# EAGLE design wakeup (EAGLE 7.7.0)

## Sheet 1 of 2: Main - Connectors and Microcontroller
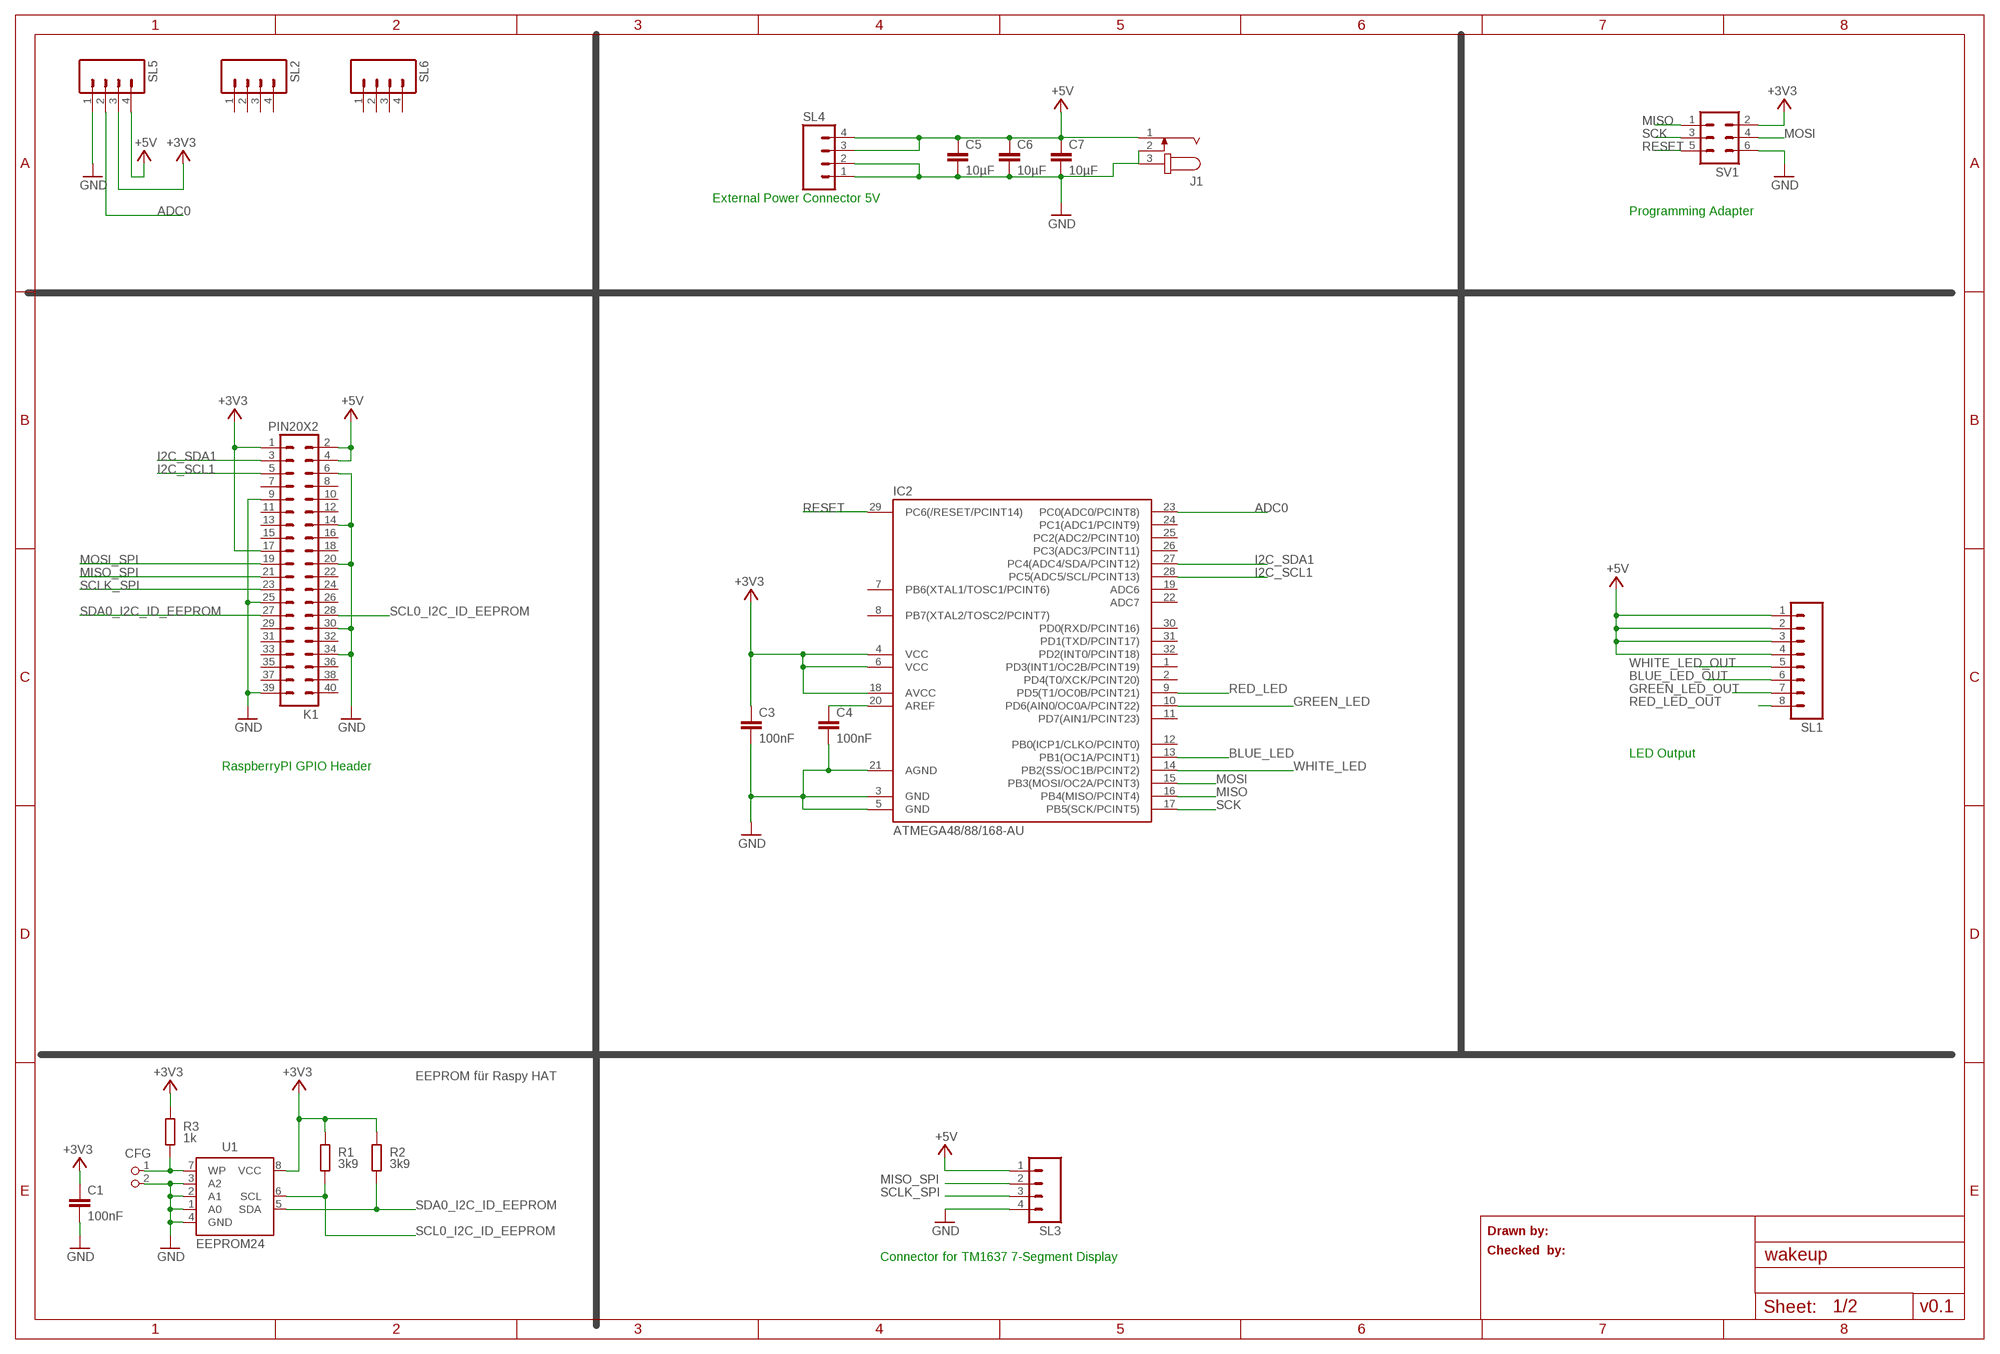
[diagram p0: schematic, sheet 1]

### Parts
C1  100nF  C-EUC0805K  [C0805K]
C3  100nF  C-EUC0603  [C0603]
C4  100nF  C-EUC0603  [C0603]
C5  10µF  C-EUC0805  [C0805]
C6  10µF  C-EUC0805  [C0805]
C7  10µF  C-EUC0805  [C0805]
CFG  PIN2_100  [PIN_W_2]
IC2  ATMEGA48/88/168-AU  [TQFP32-08]
J1  JACK-PLUG1  [SPC4078]
K1  PIN20X2  [PIN_20X2]
R1  3k9  R-EU_M0805  [M0805]
R2  3k9  R-EU_M0805  [M0805]
R3  1k  R-EU_M0805  [M0805]
SL1  M08  [08P]
SL2  M04  [04P]
SL3  M04  [04P]
SL4  M04  [04P]
SL5  M04  [04P]
SL6  M04  [04P]
SV1  ML6  [ML6]
U1  EEPROM24  [SOIC8]

### Nets
+3V3: C1.1 C3.1 IC2.4(VCC) IC2.6(VCC) IC2.18(AVCC) K1.1 K1.17 R1.2 R2.2 R3.2 SL5.3 SV1.2 U1.8(VCC)
+5V: C5.1 C6.1 C7.1 J1.1 K1.2 K1.4 SL1.1 SL1.2 SL1.3 SL1.4 SL3.1 SL4.3 SL4.4 SL5.4 ; also sheet 2
ADC0: IC2.23(PC0(ADC0/PCINT8)) SL5.2
BLUE_LED: IC2.13(PB1(OC1A/PCINT1)) ; also sheet 2
BLUE_LED_OUT: SL1.6 ; also sheet 2
GND: C1.2 C3.2 C4.2 C5.2 C6.2 C7.2 CFG.2 IC2.3(GND) IC2.5(GND) IC2.21(AGND) J1.2 J1.3 K1.6 K1.9 K1.14 K1.20 K1.25 K1.30 K1.34 K1.39 SL3.4 SL4.1 SL4.2 SL5.1 SV1.6 U1.1(A0) U1.2(A1) U1.3(A2) U1.4(GND) ; also sheet 2
GREEN_LED: IC2.10(PD6(AIN0/OC0A/PCINT22)) ; also sheet 2
GREEN_LED_OUT: SL1.7 ; also sheet 2
I2C_SCL1: IC2.28(PC5(ADC5/SCL/PCINT13)) K1.5
I2C_SDA1: IC2.27(PC4(ADC4/SDA/PCINT12)) K1.3
MISO: IC2.16(PB4(MISO/PCINT4)) SV1.1
MISO_SPI: K1.21 SL3.2
MOSI: IC2.15(PB3(MOSI/OC2A/PCINT3)) SV1.4
MOSI_SPI: K1.19
N$3: CFG.1 R3.1 U1.7(WP)
N$4: C4.1 IC2.20(AREF)
RED_LED: IC2.9(PD5(T1/OC0B/PCINT21)) ; also sheet 2
RED_LED_OUT: SL1.8 ; also sheet 2
RESET: IC2.29(PC6(/RESET/PCINT14)) SV1.5
SCK: IC2.17(PB5(SCK/PCINT5)) SV1.3
SCL0_I2C_ID_EEPROM: K1.28 R1.1 U1.6(SCL)
SCLK_SPI: K1.23 SL3.3
SDA0_I2C_ID_EEPROM: K1.27 R2.1 U1.5(SDA)
WHITE_LED: IC2.14(PB2(SS/OC1B/PCINT2)) ; also sheet 2
WHITE_LED_OUT: SL1.5 ; also sheet 2
Unconnected: IC2.1(PD3(INT1/OC2B/PCINT19)) IC2.2(PD4(T0/XCK/PCINT20)) IC2.7(PB6(XTAL1/TOSC1/PCINT6)) IC2.8(PB7(XTAL2/TOSC2/PCINT7)) IC2.11(PD7(AIN1/PCINT23)) IC2.12(PB0(ICP1/CLKO/PCINT0)) IC2.19(ADC6) IC2.22(ADC7) IC2.24(PC1(ADC1/PCINT9)) IC2.25(PC2(ADC2/PCINT10)) IC2.26(PC3(ADC3/PCINT11)) IC2.30(PD0(RXD/PCINT16)) IC2.31(PD1(TXD/PCINT17)) IC2.32(PD2(INT0/PCINT18)) K1.7 K1.8 K1.10 K1.11 K1.12 K1.13 K1.15 K1.16 K1.18 K1.22 K1.24 K1.26 K1.29 K1.31 K1.32 K1.33 K1.35 K1.36 K1.37 K1.38 K1.40 SL2.1 SL2.2 SL2.3 SL2.4 SL6.1 SL6.2 SL6.3 SL6.4

### Notes on the sheet
- External Power Connector 5V
- Programming Adapter
- LED Output
- RaspberryPI GPIO Header
- EEPROM für Raspy HAT
- Drawn by:
- Checked  by:
- Connector for TM1637 7-Segment Display
- v0.1

## Sheet 2 of 2: LEDs und LED-Treiber
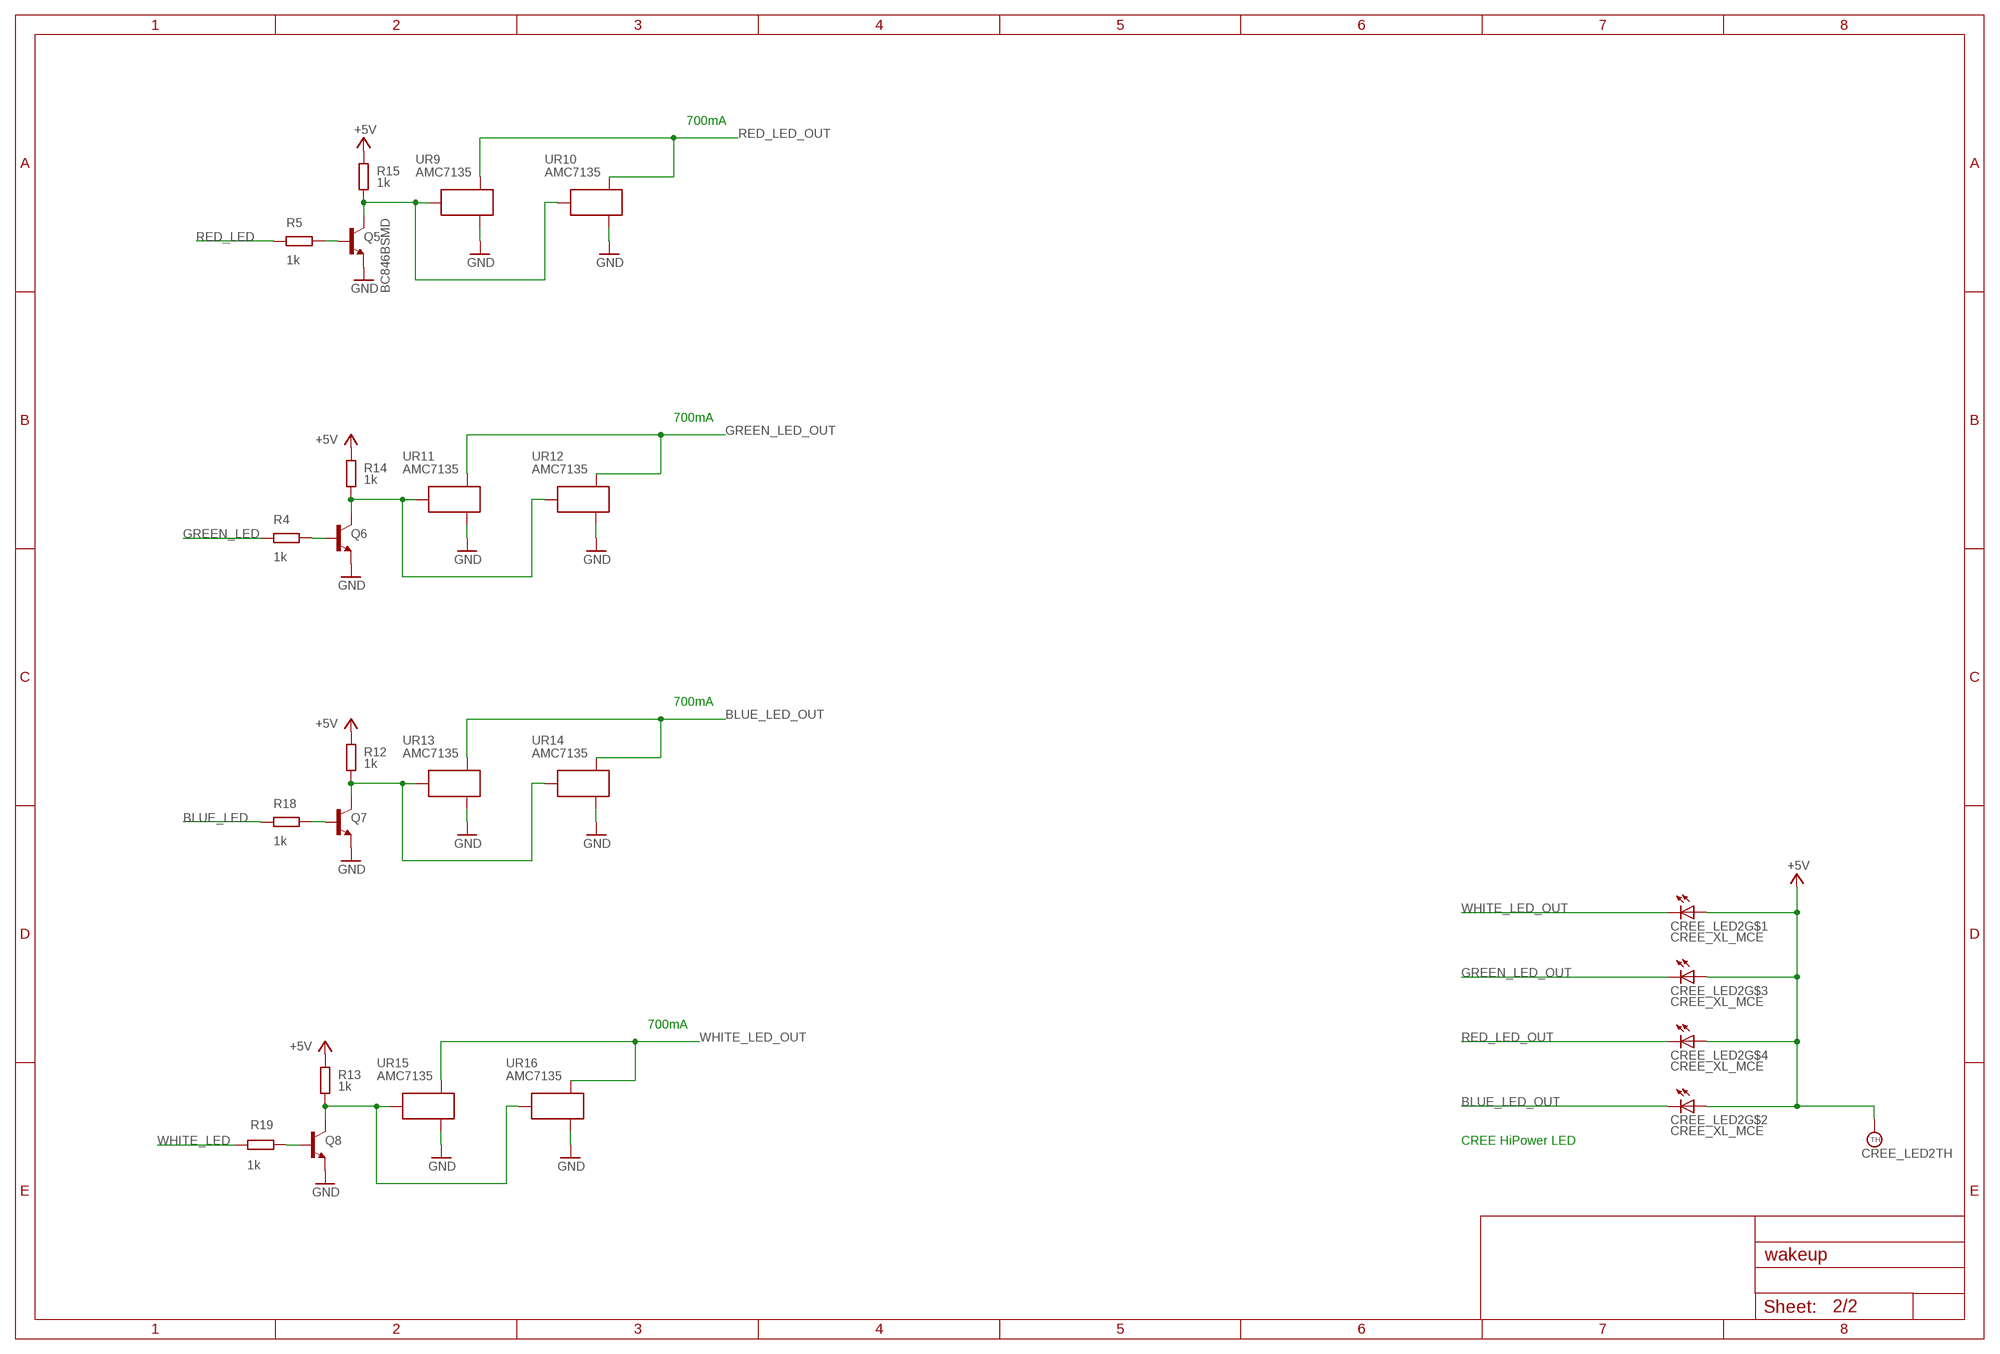
[diagram p1: schematic, sheet 2]

### Parts
CREE_LED2  CREE_XL_MCE  [CREE_XL_MCE]
Q5  BC846BSMD  [SOT23]
Q6  BC846BSMD  [SOT23]
Q7  BC846BSMD  [SOT23]
Q8  BC846BSMD  [SOT23]
R4  1k  R-EU_M0805  [M0805]
R5  1k  R-EU_M0805  [M0805]
R12  1k  R-EU_R0603  [R0603]
R13  1k  R-EU_R0603  [R0603]
R14  1k  R-EU_R0603  [R0603]
R15  1k  R-EU_R0603  [R0603]
R18  1k  R-EU_M0805  [M0805]
R19  1k  R-EU_M0805  [M0805]
UR9  AMC7135  [SOT]
UR10  AMC7135  [SOT]
UR11  AMC7135  [SOT]
UR12  AMC7135  [SOT]
UR13  AMC7135  [SOT]
UR14  AMC7135  [SOT]
UR15  AMC7135  [SOT]
UR16  AMC7135  [SOT]

### Nets
+5V: CREE_LED2.1(A) CREE_LED2.2(A) CREE_LED2.3(A) CREE_LED2.4(A) CREE_LED2.HT(TH:TH) R12.2 R13.2 R14.2 R15.2 ; also sheet 1
BLUE_LED: R18.2 ; also sheet 1
BLUE_LED_OUT: CREE_LED2.7(C) UR13.1(OUT) UR14.1(OUT) ; also sheet 1
BLUE_POWER: Q7.3(C) R12.1 UR13.3(VDD) UR14.3(VDD)
GND: Q5.2(E) Q6.2(E) Q7.2(E) Q8.2(E) UR9.2(GND) UR9.2@1(GND) UR10.2(GND) UR10.2@1(GND) UR11.2(GND) UR11.2@1(GND) UR12.2(GND) UR12.2@1(GND) UR13.2(GND) UR13.2@1(GND) UR14.2(GND) UR14.2@1(GND) UR15.2(GND) UR15.2@1(GND) UR16.2(GND) UR16.2@1(GND) ; also sheet 1
GREEN_LED: R4.2 ; also sheet 1
GREEN_LED_OUT: CREE_LED2.6(C) UR11.1(OUT) UR12.1(OUT) ; also sheet 1
GREEN_POWER: Q6.3(C) R14.1 UR11.3(VDD) UR12.3(VDD)
N$5: Q8.1(B) R19.1
N$6: Q7.1(B) R18.1
N$7: Q5.1(B) R5.1
N$8: Q6.1(B) R4.1
RED_LED: R5.2 ; also sheet 1
RED_LED_OUT: CREE_LED2.5(C) UR9.1(OUT) UR10.1(OUT) ; also sheet 1
RED_POWER: Q5.3(C) R15.1 UR9.3(VDD) UR10.3(VDD)
WHITE_LED: R19.2 ; also sheet 1
WHITE_LED_OUT: CREE_LED2.8(C) UR15.1(OUT) UR16.1(OUT) ; also sheet 1
WHITE_POWER: Q8.3(C) R13.1 UR15.3(VDD) UR16.3(VDD)

### Notes on the sheet
- 700mA
- 700mA
- 700mA
- 700mA
- CREE HiPower LED

## Library data of the parts
C1 = resistor:C-EU: CAPACITOR, European symbol; DIELECTRIC: X7R
C3-C7 = rcl:C-EU: CAPACITOR, European symbol
CFG = FLYFISH:PIN2
CREE_LED2 = CreeXL-MC-E:CREE_XL_MCE: Cree® LED
IC2 = atmega8:ATMEGA48/88/168
J1 = con-jack:JACK-PLUG: DC POWER JACK Power Jack, DC, Right Angle, Through Hole, Rated 5A at 16VDC, PC Terminals Distributor: Farnell (www.Farnell.de) Drawing: 84N1161.pdf / 84N1162.pdf Manufacturer: SPC Technology (www.spctechnology.com) Type: SPC4077 / SPC 4078; OC_FARNELL: unknown; OC_NEWARK: unknown
K1 = FLYFISH:PIN20X2
Q5-Q8 = transistor-npn:BC846*: NPN Transistor
R1-R5 R12-R15 R18 R19 = resistor:R-EU_: RESISTOR, European symbol; TOLERANCE: 5%
SL1 = con-amp-quick:M08: AMP QUICK CONNECTOR; OC_FARNELL: unknown; OC_NEWARK: unknown
SL2-SL6 = con-amp-quick:M04: AMP QUICK CONNECTOR; OC_FARNELL: unknown; OC_NEWARK: unknown
SV1 = con-ml:ML6: HARTING; OC_FARNELL: unknown; OC_NEWARK: unknown
U1 = FLYFISH:EEPROM24
UR9-UR16 = 1:AMC7135: Spannungsregler AMC7135 http://www.micro-bridge.com/data/add/amc7135.pdf

## Board
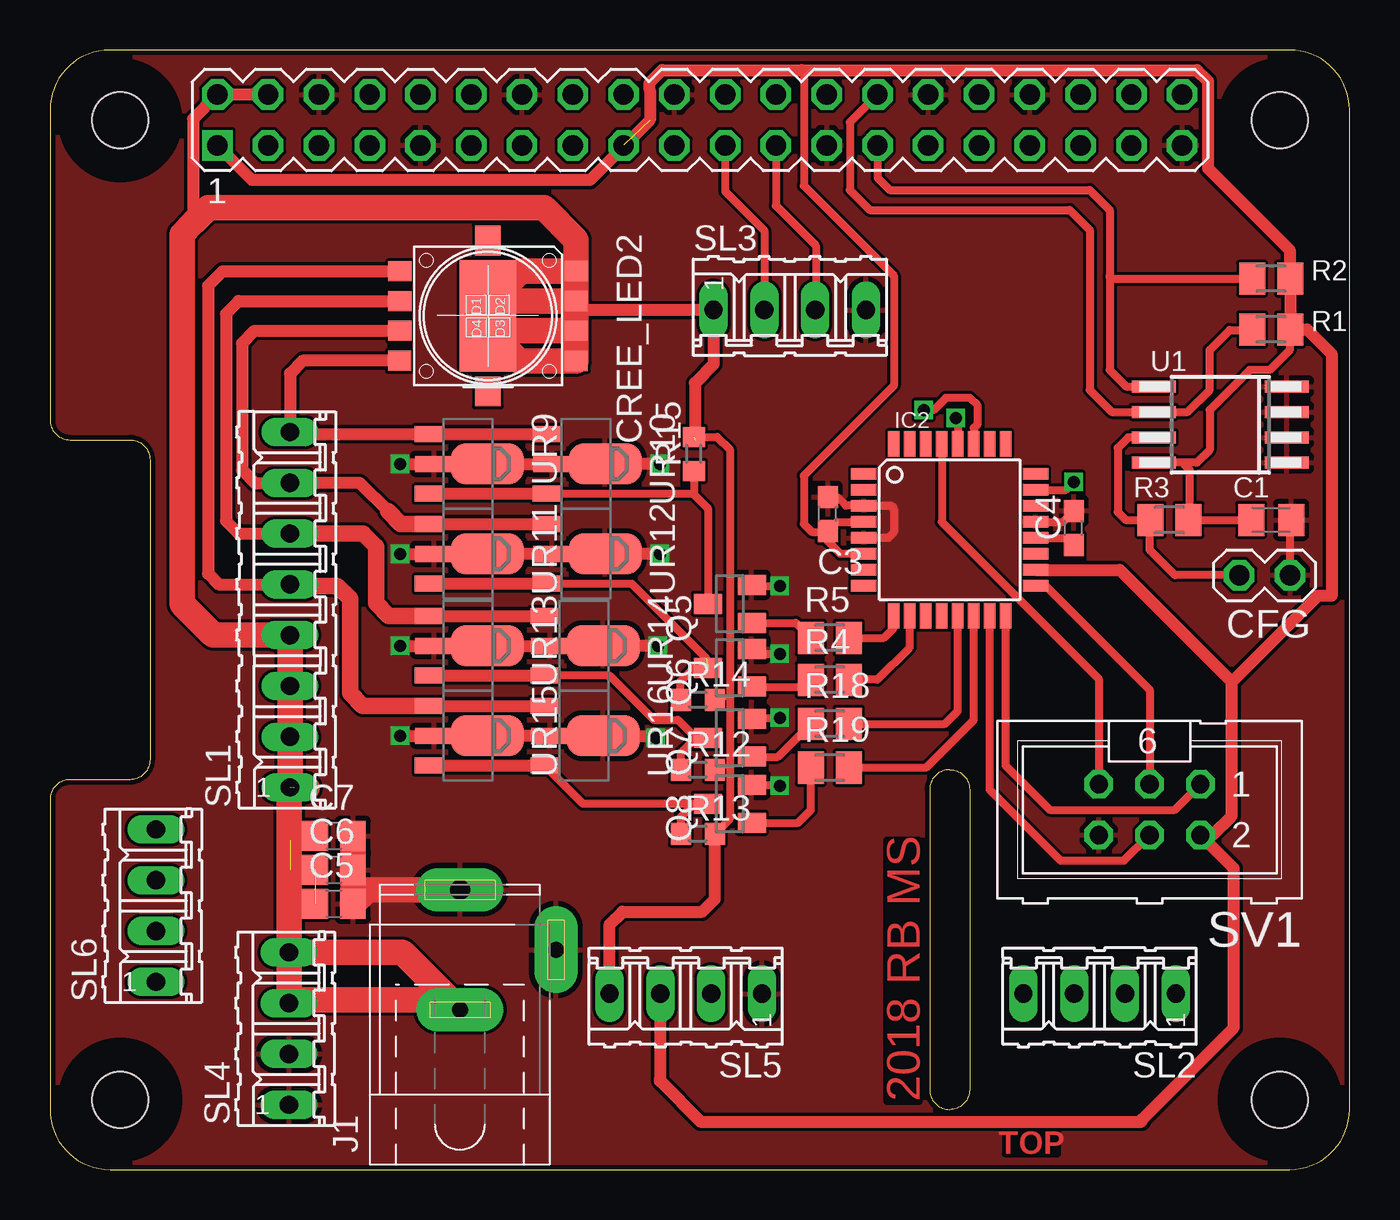
[diagram p2: board, top side]
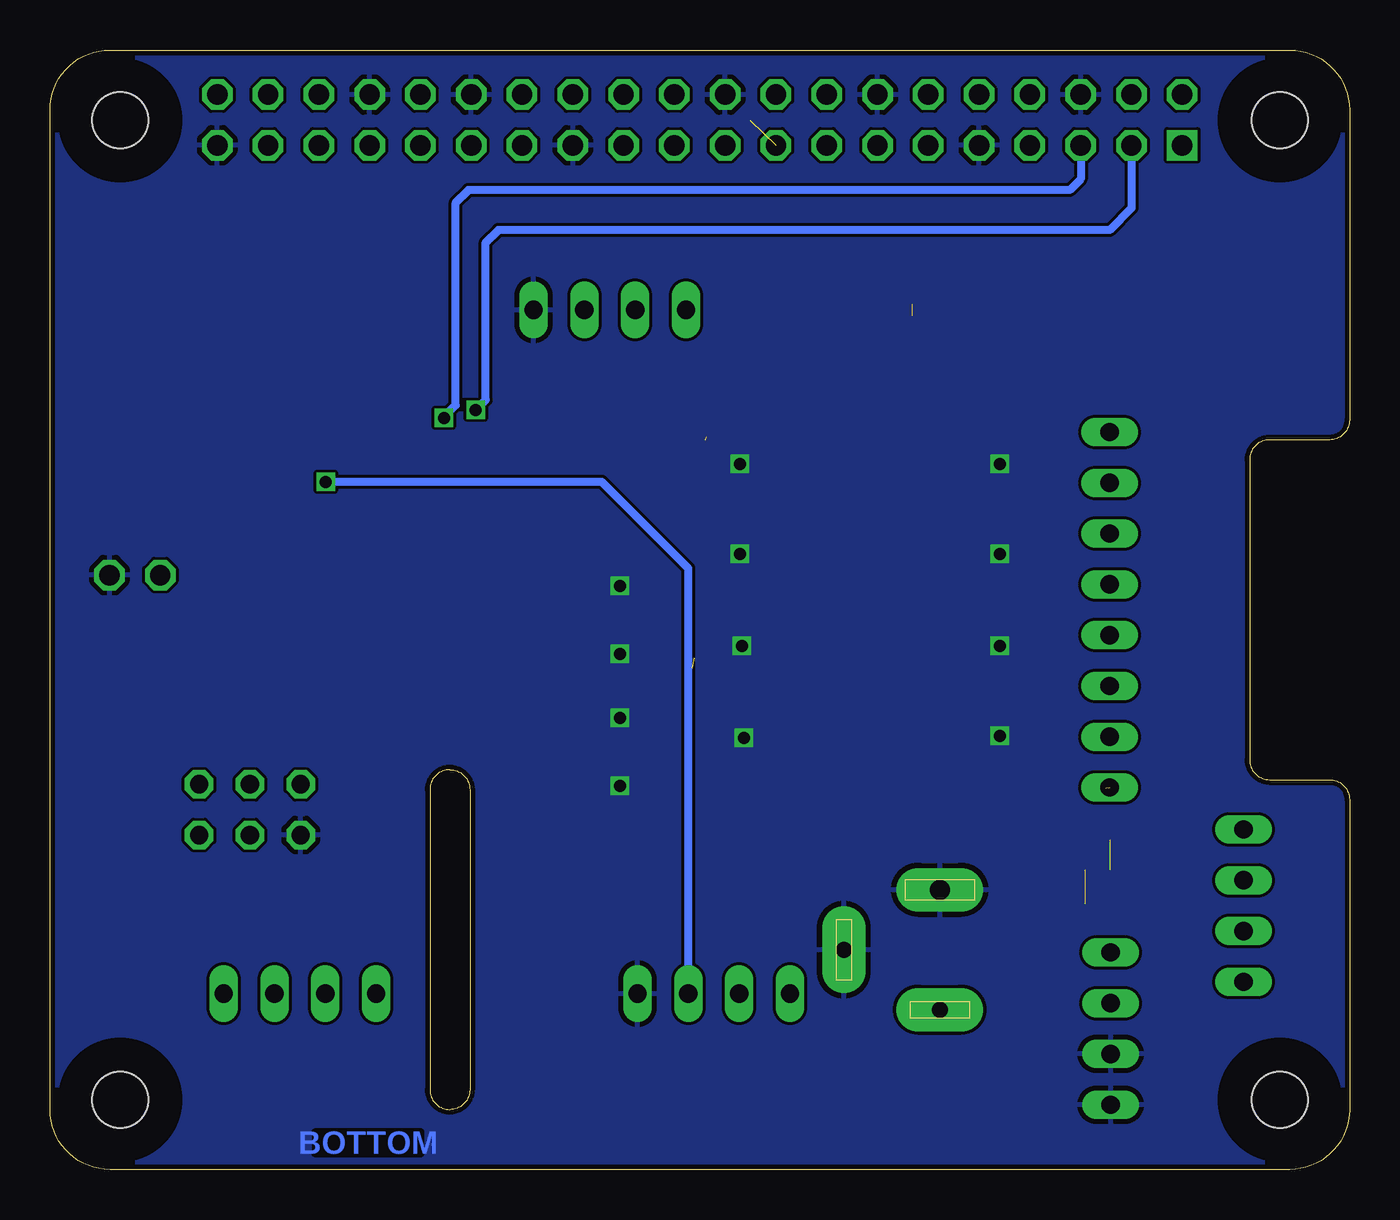
[diagram p3: board, bottom side, seen from below]

Size 65 x 56 mm. Coordinates in mm from the lower left corner, seen from the top.
Outline: 0,3 arc90 3,0 62,0 arc90 65,3 65,53 arc90 62,56 3,56 arc90 0,53 0,37.5 arc90 1,36.5 4,36.5 arc-90 5,35.5 5,20.5 arc-90 4,19.5 1,19.5 arc90 0,18.5 0,3
Outline: 44,19 44,4 arc90 45,3 arc90 46,4 46,19 arc90 45,20 arc90 44,19
Copper layers (1*16): Top 0.035mm / dielectric 1.5mm / Bottom 0.035mm
Design rules "ITEADstudio_DRC *": minimum track width 6mil, minimum drill 12mil, track to track 6mil, track to pad 6mil, pad to pad 6mil, via to via 6mil, smd to smd 0mil, copper to edge 10mil, drill to drill 10mil, minimum pad ring 10mil, minimum via ring 6mil, stop-mask expansion 2mil, vias tented up to drill 100mil, thermal gap 10mil
Holes 2.8 mm at 3.5,3.5 3.5,52.5 61.5,52.5 61.5,3.5
tRestrict: area 1.9,51 to 5,54; area 60,51 to 63,54; area 60,1.9 to 63,5; area 1.9,1.9 to 5,5
bRestrict: area 1.9,1.9 to 5,5; area 1.9,51 to 5,54; area 60,1.9 to 63,5; area 60,51 to 63,54
Milling: 6 lines

### Footprints (pad centres in the part's own frame; a part is rotated, then mirrored left to right if it is on the bottom)
C0805K = smd 1.3 x 1.6: 1 -1,0; 2 1,0
C0603 = smd 1.1 x 1: 1 -0.85,0; 2 0.85,0
C0805 = smd 1.3 x 1.5: 1 -0.95,0; 2 0.95,0
PIN_W_2 = drill 1.016 octagon: 1 0,0; 2 0,-2.54
CREE_XL_MCE = smd 1 x 1.16: 1 -2.24,4.42; 2 -0.739,4.408; 3 0.739,4.408; 4 2.256,4.408; 5 2.246,-4.408; 6 0.749,-4.399; 7 -0.739,-4.399; 8 -2.237,-4.399 | smd 5.6 x 2.84: HT 0,0 | smd 1.492 x 1.3: P$9 3.778,0; P$10 -3.767,0
TQFP32-08 = smd 1.27 x 0.559: 1 -4.293,2.8; 2 -4.293,2; 3 -4.293,1.2; 4 -4.293,0.4; 5 -4.293,-0.4; 6 -4.293,-1.2; 7 -4.293,-2; 8 -4.293,-2.8; 17 4.293,-2.8; 18 4.293,-2; 19 4.293,-1.2; 20 4.293,-0.4; 21 4.293,0.4; 22 4.293,1.2; 23 4.293,2; 24 4.293,2.8 | smd 0.559 x 1.27: 9 -2.8,-4.293; 10 -2,-4.293; 11 -1.2,-4.293; 12 -0.4,-4.293; 13 0.4,-4.293; 14 1.2,-4.293; 15 2,-4.293; 16 2.8,-4.293; 25 2.8,4.293; 26 2,4.293; 27 1.2,4.293; 28 0.4,4.293; 29 -0.4,4.293; 30 -1.2,4.293; 31 -2,4.293; 32 -2.8,4.293
SPC4078 = drill 0.8 pad 2.184 long: 1 -3,0; 2 0,-4.8 | drill 1 pad 2.184 long: 3 3,0
PIN_20X2 = drill 1.016 square: 1 -24.13,-1.27 | drill 1.016 octagon: 2 -24.13,1.27; 3 -21.59,-1.27; 4 -21.59,1.27; 5 -19.05,-1.27; 6 -19.05,1.27; 7 -16.51,-1.27; 8 -16.51,1.27; 9 -13.97,-1.27; 10 -13.97,1.27; 11 -11.43,-1.27; 12 -11.43,1.27; 13 -8.89,-1.27; 14 -8.89,1.27; 15 -6.35,-1.27; 16 -6.35,1.27; 17 -3.81,-1.27; 18 -3.81,1.27; 19 -1.27,-1.27; 20 -1.27,1.27; 21 1.27,-1.27; 22 1.27,1.27; 23 3.81,-1.27; 24 3.81,1.27; 25 6.35,-1.27; 26 6.35,1.27; 27 8.89,-1.27; 28 8.89,1.27; 29 11.43,-1.27; 30 11.43,1.27; 31 13.97,-1.27; 32 13.97,1.27; 33 16.51,-1.27; 34 16.51,1.27; 35 19.05,-1.27; 36 19.05,1.27; 37 21.59,-1.27; 38 21.59,1.27; 39 24.13,-1.27; 40 24.13,1.27
SOT23 = smd 1 x 1.4: 1 -0.95,-1.1; 2 0.95,-1.1; 3 0,1.1
M0805 = smd 1.3 x 1.6: 1 -0.95,0; 2 0.95,0
R0603 = smd 1 x 1.1: 1 -0.85,0; 2 0.85,0
08P = drill 0.914 long: 1 -8.89,0; 2 -6.35,0; 3 -3.81,0; 4 -1.27,0; 5 1.27,0; 6 3.81,0; 7 6.35,0; 8 8.89,0
04P = drill 0.914 long: 1 -3.81,0; 2 -1.27,0; 3 1.27,0; 4 3.81,0
ML6 = drill 0.914 octagon: 1 -2.54,-1.27; 2 -2.54,1.27; 3 0,-1.27; 4 0,1.27; 5 2.54,-1.27; 6 2.54,1.27
SOIC8 = smd 0.6 x 2.2: 1 -1.905,-3.33; 2 -0.635,-3.33; 3 0.635,-3.33; 4 1.905,-3.33; 5 1.905,3.33; 6 0.635,3.33; 7 -0.635,3.33; 8 -1.905,3.33
SOT = smd 0.8 x 1.4: 1 -1.499,-3.251; 3 1.499,-3.251 | smd 0.8 x 1.9: 2 0,-2.997 | smd 2.032 x 3.65: 2@1 0,-0.33

### Placement (x,y rotation side)
C1  61.08,32.5 0 top
C3  38.9,32.8 90 top
C4  51.2,32.1 90 top
C5  14.2,13.3 0 top
C6  14.2,15 0 top
C7  14.2,16.7 0 top
CFG  59.48,29.73 90 top
CREE_LED2  21.9,42.7 270 top
IC2  45,32 0 top
J1  20.5,11 90 top
K1  32.5,52.5 0 top
Q5  34,28.3 90 top
Q6  34,25.1 90 top
Q7  34,21.6 90 top
Q8  34,18.3 90 top
R1  61.08,42.02 0 top
R2  61.08,44.56 0 top
R3  55.99,32.5 0 top
R4  39,24.5 0 top
R5  39,26.6 0 top
R12  32.4,20 0 top
R13  32.4,16.8 0 top
R14  32.4,23.5 0 top
R15  32.2,35.8 90 top
R18  39,22.3 0 top
R19  39,20.1 0 top
SL1  12,28 90 top
SL2  52.5,8.8 180 top
SL3  37,43 0 top
SL4  11.95,7.05 90 top
SL5  31.8,8.8 180 top
SL6  5.3,13.2 90 top
SV1  55,18 180 top
U1  58.53,37.26 90 top
UR9  22.2,35.3 270 top
UR10  28.1,35.3 270 top
UR11  22.2,30.8 270 top
UR12  28.1,30.8 270 top
UR13  22.2,26.2 270 top
UR14  28,26.2 270 top
UR15  22.2,21.7 270 top
UR16  28,21.7 270 top

### Tracks (layer width: path | path; a pad name or v marks a point on that pad's centre or on a via)
+3V3  (1 unrouted)
  Top 0.406: C1.1 R3.2 57,32.55 57,35 56.65,35.35 | 56.65,35.35 57.35,35.35 58,36 58,38 60,40 61,40 62.02,41.02 R1.2 | 56.65,35.35 U1.8 | 62,44.59 R2.2 | 30,54 | C3.1 39.35,32.4 IC2.4 | IC2.6 39.53,30.8 38.9,31.43 C3.1 | 37.6,55 37.7,54.9 37.7,49.2 42.2,44.7 42.2,39.2 37.7,34.7 37.7,32.3 38.1,31.9 38.85,31.9 C3.1 | 38.75,32.1 C3.1 | 30.5,4.54 30.5,4.43 | 54.6,2.4 54.6,2.5
  Top 0.61: R2.2 R1.2 62.88,42.02 64.1,40.8 64.1,28.7 63.4,28.7 59.1,24.4 | 62,44.59 62,46 57.92,50.08 57.92,54.45 57.37,55 37.6,55 30.62,55 30,54.38 30,54 | 30,54 30,52.5 27,49.5 10.1,49.5 K1.1 | IC2.18 53.5,30 59.1,24.4 | SL5.3 30.5,8.77 30.5,4.54 | 54.6,2.4 32.53,2.4 30.5,4.43 | 54.6,2.5 59.2,7.1 59.2,15.07 SV1.2 58.13,16.73 59.1,17.7 59.1,24.4
+5V  (5 unrouted)
  Top 0.254: 34,23.6 33.35,23.6 R14.2 | R12.2 33.25,20.2 34,20.2
  Top 0.406: R15.2 33.37,36.65 34,36.02 34,23.6 34,20.2 34,17.55 R13.2 | 12.2,16.7 arc90 12,16.5
  Top 0.61: K1.4 K1.2 7.15,52.55 7.15,47.35 | SL5.4 27.99,12.27 28.62,12.9 32.62,12.9 33.25,13.54 R13.2 | CREE_LED2.2 26.75,43 SL3.1 33.19,40.29 32.25,39.35 32.25,36.5 32,36.5
  Top 1.27: 12.85,19.1 12.2,19.1 | 22.06,41.96 22,41.9 22.2,41.7 | CREE_LED2.2 26.31,46.49 24.7,48.1 7.9,48.1 7.15,47.35 6.6,46.8 6.6,28.3 8.17,26.73 SL1.4 SL1.3 SL1.2 SL1.1 arc90 11.95,19.06 11.95,13 | CREE_LED2.2 CREE_LED2.3 | CREE_LED2.3 CREE_LED2.4 23.46,40.44 22.2,41.7 | CREE_LED2.1 23.54,44.94 22.05,43.45 | 22.05,43.45 21.9,43.3 | CREE_LED2.3 22.46,41.96 22.2,41.7 | CREE_LED2.2 22.06,43.44 22.05,43.45 | C7.1 12.2,16.7 | C6.1 12,15 | SL4.3 SL4.4 | SL4.4 11.95,13 | C5.1 12.25,13.3 arc90 11.95,13 | SL4.4 17.64,10.86 J1.1 20,8.5 12,8.5
ADC0  (via drill 0.6)
  Top 0.406: IC2.23 50.8,34 v51.2,34.4
  Bottom 0.406: SL5.2 33.07,30.07 37.4,34.4 v51.2,34.4
BLUE_LED
  Top 0.406: R18.2 44.77,22.3 45.4,22.93 IC2.13
BLUE_LED_OUT
  Top 0.61: UR13.1 UR14.1 | CREE_LED2.7 9.44,43.44 8.8,42.8 8.8,32.45 9.44,31.81 SL1.6
  Top 0.813: SL1.6 15.66,31.81 16.3,31.18 16.3,28.33 16.93,27.7 UR13.1
BLUE_POWER
  Top 0.254: Q7.3 32.3,21.6 | 27.9,24.7 28,24.7
  Top 0.406: 27.9,24.7 UR14.3 | 28,24.7 30.2,22.5 31.4,22.5 32.3,21.6 31.55,20.85 R12.1
  Top 0.61: UR13.3 UR14.3
GND  (via drill 0.6)
  Top 0.406: IC2.5 41.94,31.6 42.21,31.87 42.21,33 arc90 42.01,33.2 IC2.3 39.8,33.2 39.35,33.65 C3.2 | Q7.2 35.15,22.6 v36.5,22.6 | CFG.2 62.02,32.45 C1.2 | Q8.2 36.45,19.25 v36.5,19.2 | IC2.21 50.65,32.4 C4.2 | Q5.2 35.05,29.2 v36.5,29.2 | 30.2,21.7 v30.3,21.6 | 35.05,25.8 v36.5,25.8
  Top 0.61: 30.6,35.3 v30.5,35.3 UR10.2@1 UR10.2 UR9.2@1 UR9.2 v17.5,35.3 | v30.5,30.8 UR12.2@1 | UR12.2 UR11.2@1 | v17.5,30.8 UR11.2 | v30.4,26.2 UR14.2@1 UR14.2 UR13.2@1 UR13.2 v17.5,26.2 | UR15.2@1 UR16.2 UR16.2@1 30.2,21.7 | v17.5,21.7 UR15.2
  Top 1.27: C7.2 C5.2 15.85,14 J1.3
  pour Bottom: 0,3 arc90 3,0 62,0 arc90 65,3 65,53 arc90 62,56 3,56 arc90 0,53 0,37.5 arc90 1,36.5 4,36.5 arc-90 5,35.5 5,20.5 arc-90 4,19.5 1,19.5 arc90 0,18.5
  pour Top: 0,3 arc90 3,0 62,0 arc90 65,3 65,53 arc90 62,56 3,56 arc90 0,53 0,37.5 arc90 1,36.5 4,36.5 arc-90 5,35.5 5,20.5 arc-90 4,19.5 1,19.5 arc90 0,18.5
GREEN_LED
  Top 0.406: IC2.10 43,26.12 41.38,24.5 R4.2
GREEN_LED_OUT
  Top 0.61: UR11.1 UR12.1 | CREE_LED2.6 10.23,41.95 9.6,41.32 9.6,34.98 10.23,34.35 SL1.7 15.48,34.35 16.9,32.93
  Top 0.813: 16.9,32.93 17.54,32.3 UR11.1
GREEN_POWER  (1 unrouted)
  Top 0.254: 32.2,25.1 Q6.3
  Top 0.406: UR12.3 29.1,29.3 32.8,25.6 | R14.1 31.5,23.55 31.5,24.4 32.2,25.1
  Top 0.61: UR11.3 UR12.3
I2C_SCL1  (via drill 0.6)
  Top 0.406: v45.3,37.6 45.4,37.5 IC2.28
  Bottom 0.406: K1.5 13.45,49.55 14,49 44.06,49 44.7,48.37 44.7,38.23 45.34,37.6 v45.3,37.6
I2C_SDA1  (via drill 0.6)
  Top 0.406: v43.7,38 44.2,38 44.8,38.6 46,38.6 46.4,38.2 46.4,37.3 46.2,37.1 IC2.27
  Bottom 0.406: K1.3 10.91,48.09 12,47 42.56,47 43.2,46.37 43.2,38.5 v43.7,38
MISO
  Top 0.406: SV1.1 56.27,18 50,18 47.8,20.2 IC2.16
MISO_SPI
  Top 0.406: K1.21 33.77,48.93 35.73,46.97 SL3.2
MOSI
  Top 0.406: SV1.4 53.72,15.45 50.55,15.45 47,19 IC2.15
N$3
  Top 0.406: CFG.1 56.27,29.73 55,31 55,32.45 R3.1 53.8,32.5 53.4,32.9 53.4,36.1 53.92,36.62 U1.7
N$4
  Top 0.406: IC2.20 50.85,31.6 C4.1
N$5
  Top 0.406: Q8.1 37.41,17.35 38.05,17.98 R19.1
N$6
  Top 0.406: Q7.1 36.4,20.65 R18.1
N$7
  Top 0.406: Q5.1 37.3,27.35 R5.1
N$8
  Top 0.254: 37.7,24.15 R4.1
  Top 0.406: Q6.1 37.7,24.15
RED_LED
  Top 0.406: 42.16,27.67 IC2.9 42.2,27.1 41.7,26.6 R5.2
RED_LED_OUT
  Top 0.61: 12.11,36.89 SL1.8 12,39.82 12.63,40.45 CREE_LED2.5 | 12.2,36.8 UR9.1 UR10.1
  Top 0.813: 12.11,36.89 12.2,36.8
RED_POWER
  Top 0.406: UR10.3 32.16,33.8 | 32.16,33.8 32.9,33.07 Q5.3 | R15.1 32.2,33.84 arc-90 32.16,33.8
  Top 0.61: UR9.3 UR10.3
RESET
  Top 0.406: IC2.29 44.6,32.4 52.46,24.54 SV1.5
SCK
  Top 0.406: IC2.17 49.8,29.2 55,24 SV1.3
SCL0_I2C_ID_EEPROM
  Top 0.406: R1.1 60.1,42 59,42 58,41 58,39 56.9,37.9 U1.6 53.1,37.9 52,39 52,47 51,48 41,48 40,49 40,52.38 K1.28
SCLK_SPI
  Top 0.406: K1.23 36.3,48.2 38.3,46.2 38.3,43.03 SL3.3
SDA0_I2C_ID_EEPROM
  Top 0.406: R2.1 53.14,44.56 arc-90 53,44.7 | U1.5 53.84,39.16 53,40 53,44.7 | 53,44.7 53,48 52,49 42,49 41.39,49.61 K1.27
WHITE_LED
  Top 0.406: IC2.14 46.2,22.5 43.8,20.1 R19.2
WHITE_LED_OUT
  Top 0.61: UR15.1 UR16.1 | CREE_LED2.8 8.63,44.94 7.9,44.2 7.9,29.8 8.44,29.27 SL1.5
  Top 0.813: SL1.5 12.07,29.2 14.37,29.2 15,28.57 15,23.83 15.63,23.2 UR15.1
WHITE_POWER
  Top 0.254: 32.1,18.2 32.8,18.2 Q8.3
  Top 0.406: R13.1 31.55,17.65 32.1,18.2 | Q8.3 26.65,18.3 UR16.3
  Top 0.61: UR15.3 UR16.3

### Text on the board
Top: 2018 RB MS | TOP
Bottom: BOTTOM